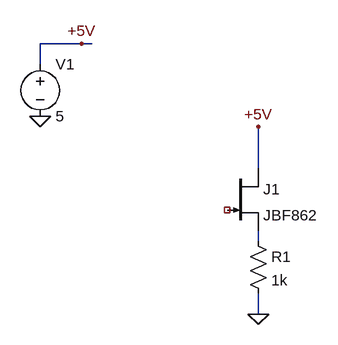
[diagram p0: schematic Draft1.asc]
Draft1.asc, the LTspice schematic file:
Version 4
SHEET 1 880 680
WIRE -128 -128 -192 -128
WIRE -112 -128 -128 -128
WIRE -192 -96 -192 -128
WIRE 144 64 144 0
WIRE 144 176 144 160
WIRE 144 288 144 256
FLAG 144 0 +5V
FLAG 144 288 0
FLAG -192 -16 0
FLAG -128 -128 +5V
SYMBOL njf 96 64 R0
SYMATTR InstName J1
SYMATTR Value JBF862
SYMBOL res 128 160 R0
SYMATTR InstName R1
SYMATTR Value 1k
SYMBOL voltage -192 -112 R0
WINDOW 123 0 0 Left 2
WINDOW 39 24 44 Left 2
SYMATTR InstName V1
SYMATTR Value 5

The netlist it stands for:
* Draft1.asc
J1 +5V NC_01 N001 JBF862
R1 N001 0 1k
V1 +5V 0 5
.model NJF NJF
.model PJF PJF
.lib standard.jft
.backanno
.end